# Altium schematic sheet Tripwire.SchDoc
size A4
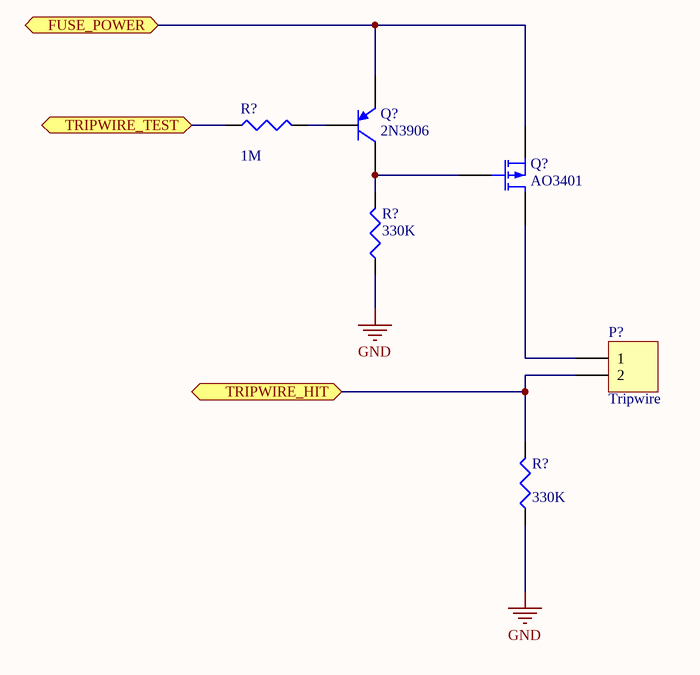
[diagram p0: Tripwire.SchDoc]

## Parts
(Parts that share a designator on the sheet are numbered #1, #2 ... from top to bottom, then left to right.)
P?  Tripwire  [HDR1X2]
Q?#1  2N3906  [SOT-23B_N]
Q?#2  AO3401  [E3]
R?#1  value 1M  [12Z-2010]  (hidden comment: Res3)
R?#2  value 330K  [12Z-2010]  (hidden comment: Res3)
R?#3  value 330K  [12Z-2010]  (hidden comment: Res3)

## Ports
FUSE_POWER (bidir), TRIPWIRE_HIT (bidir), TRIPWIRE_TEST (bidir)

## Nets
GND: R?#2.1 R?#3.1
FUSE_POWER: Q?#1.3(E) Q?#2.3(S) ; port FUSE_POWER
TRIPWIRE_HIT: P?.2 R?#3.2 ; port TRIPWIRE_HIT
TRIPWIRE_TEST: R?#1.1 ; port TRIPWIRE_TEST
NetP?_1: P?.1 Q?#2.1(D)
NetQ?#1_1: Q?#1.1(C) Q?#2.2(G) R?#2.2
NetQ?#1_2: Q?#1.2(B) R?#1.2

## Library data of the parts
P? = Header 2: Header, 2-Pin; LatestRevisionDate: 17-Jul-2002; LatestRevisionNote: Re-released for DXP Platform.; Publisher: Altium Limited
Q?#1 = PNP: PNP Bipolar Transistor; Published: 8-Jun-2000; LatestRevisionDate: 29-May-2009; LatestRevisionNote: IPC-7351 Footprint Added.; PackageVersion: Aug-1999; PackageReference: SOT-23B; Publisher: Altium Limited; PackageDescription: 3-Pin SOT-23 Package 0.95 mm Pitch, 2.4 mm Lead Span
Q?#2 = MOSFET-P: P-Channel MOSFET; Published: 8-Jun-2000; LatestRevisionDate: 17-Jul-2002; LatestRevisionNote: Re-released for DXP Platform.; PackageVersion: 1995/1996; PackageReference: E3; Publisher: Altium Limited; PackageDescription: TO, Flat Index; 3 In-Line, Axial Leads; Body Dia. 4.6mm; Lead Dia. 0.5 mm (max)
R?#1-R?#3 = Res3: Resistor; Published: 8-Jun-2000; LatestRevisionDate: 29-May-2009; LatestRevisionNote: IPC-7351 Footprint Added.; PackageReference: J1-0603; Publisher: Altium Limited; PackageDescription: Chip Resistor